# Altium project Napelem_inverter.PrjPcb (part 2 of 2)

## Sheet Connectors.SchDoc
size A4
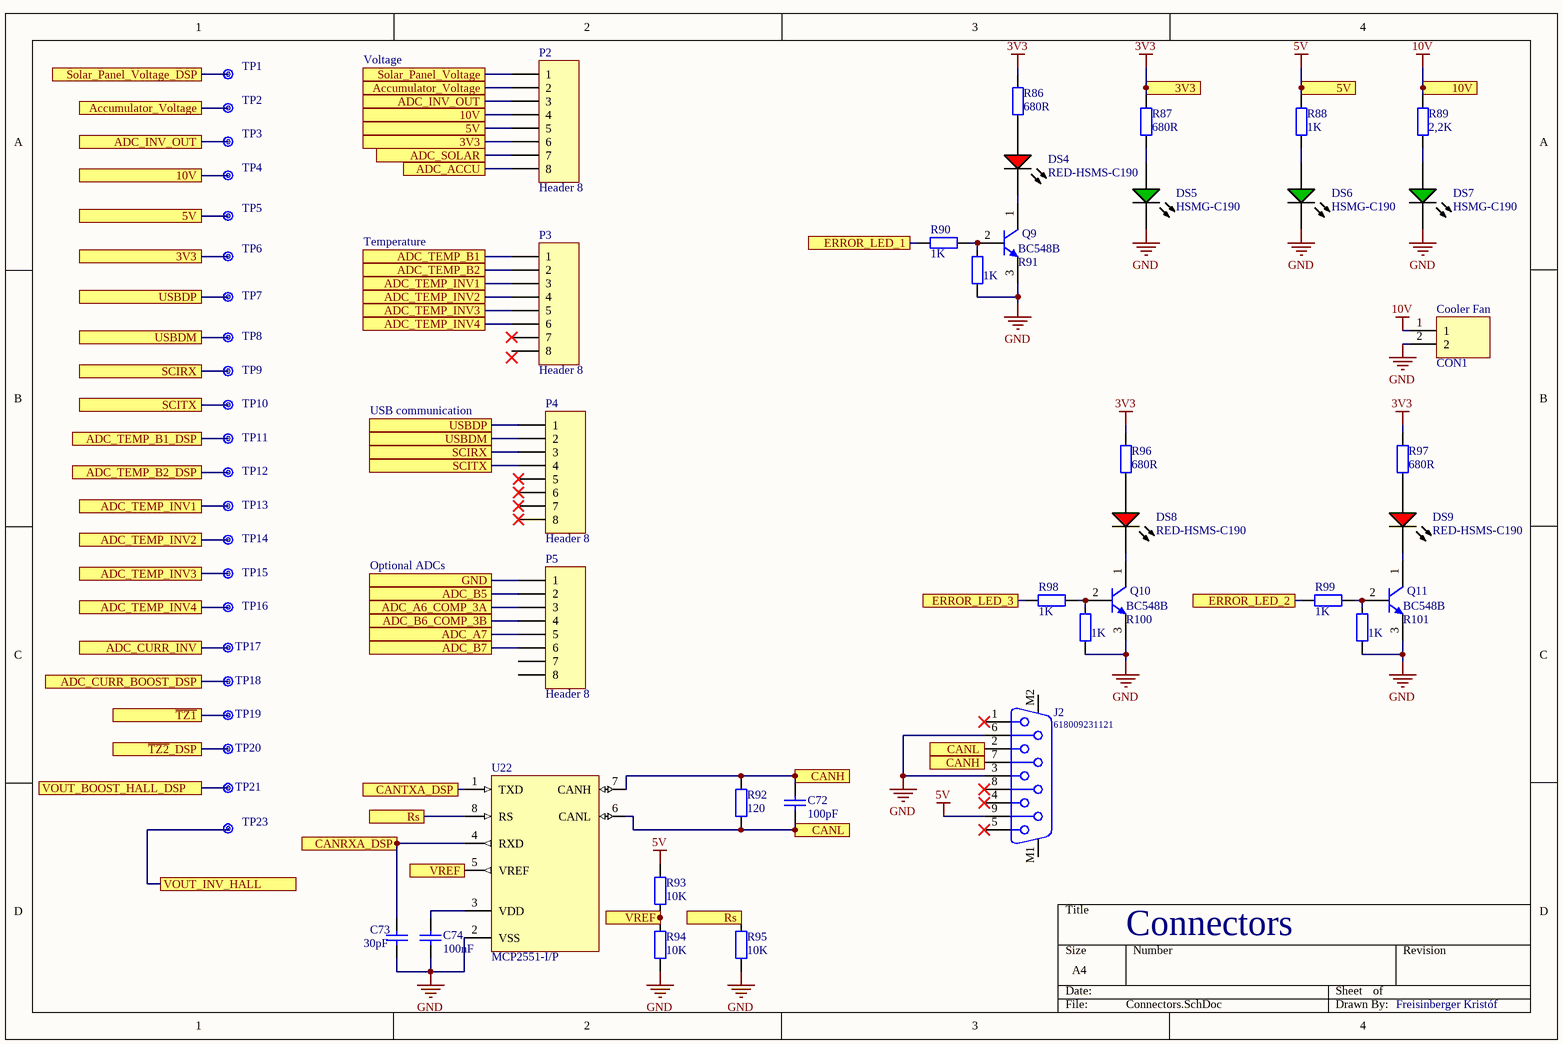
[diagram p7: Connectors.SchDoc]

### Parts
C72  100pF  [FP_0805_CAP_085]
C73  30pF  [FP_0805_CAP_085]
C74  100nF  [FP_0805_CAP_085]
CON1  Connector  [FP_CONN2_TAP_254MM_90]  (value not drawn)
DS4  RED-HSMS-C190  [AVAG-HSMX-C190_V]
DS5  HSMG-C190  [AVAG-HSMX-C190_V]
DS6  HSMG-C190  [AVAG-HSMX-C190_V]
DS7  HSMG-C190  [AVAG-HSMX-C190_V]
DS8  RED-HSMS-C190  [AVAG-HSMX-C190_V]
DS9  RED-HSMS-C190  [AVAG-HSMX-C190_V]
J2  618009231121  [618009231121]
P2  Header 8  [HDR1X8]
P3  Header 8  [HDR1X8]
P4  Header 8  [HDR1X8]
P5  Header 8  [HDR1X8]
Q9  BC548B  [ONSC-TO-92-3-29-11_AM_BL]
Q10  BC548B  [ONSC-TO-92-3-29-11_AM_BL]
Q11  BC548B  [ONSC-TO-92-3-29-11_AM_BL]
R86  680R  [FP_0805_RES]
R87  680R  [FP_0805_RES]
R88  1K  [FP_0805_RES]
R89  2,2K  [FP_0805_RES]
R90  1K  [FP_0805_RES]
R91  1K  [FP_0805_RES]
R92  120  [FP_0805_RES]
R93  10K  [FP_0805_RES]
R94  10K  [FP_0805_RES]
R95  10K  [FP_0805_RES]
R96  680R  [FP_0805_RES]
R97  680R  [FP_0805_RES]
R98  1K  [FP_0805_RES]
R99  1K  [FP_0805_RES]
R100  1K  [FP_0805_RES]
R101  1K  [FP_0805_RES]
TP1  TestPoint  [Test_Point]  (value not drawn)  (no BOM)
TP2  TestPoint  [Test_Point]  (value not drawn)  (no BOM)
TP3  TestPoint  [Test_Point]  (value not drawn)  (no BOM)
TP4  TestPoint  [Test_Point]  (value not drawn)  (no BOM)
TP5  TestPoint  [Test_Point]  (value not drawn)  (no BOM)
TP6  TestPoint  [Test_Point]  (value not drawn)  (no BOM)
TP7  TestPoint  [Test_Point]  (value not drawn)  (no BOM)
TP8  TestPoint  [Test_Point]  (value not drawn)  (no BOM)
TP9  TestPoint  [Test_Point]  (value not drawn)  (no BOM)
TP10  TestPoint  [Test_Point]  (value not drawn)  (no BOM)
TP11  TestPoint  [Test_Point]  (value not drawn)  (no BOM)
TP12  TestPoint  [Test_Point]  (value not drawn)  (no BOM)
TP13  TestPoint  [Test_Point]  (value not drawn)  (no BOM)
TP14  TestPoint  [Test_Point]  (value not drawn)  (no BOM)
TP15  TestPoint  [Test_Point]  (value not drawn)  (no BOM)
TP16  TestPoint  [Test_Point]  (value not drawn)  (no BOM)
TP17  TestPoint  [Test_Point]  (value not drawn)  (no BOM)
TP18  TestPoint  [Test_Point]  (value not drawn)  (no BOM)
TP19  TestPoint  [Test_Point]  (value not drawn)  (no BOM)
TP20  TestPoint  [Test_Point]  (value not drawn)  (no BOM)
TP21  TestPoint  [Test_Point]  (value not drawn)  (no BOM)
TP23  TestPoint  [Test_Point]  (value not drawn)  (no BOM)
U22  MCP2551-I/P  [PDIP300-P8]

### Ports
3V3, 5V, 10V, Accumulator_Voltage, ADC_A6_COMP_3A, ADC_A7, ADC_ACCU, ADC_B5, ADC_B6_COMP_3B, ADC_B7, ADC_CURR_BOOST_DSP, ADC_CURR_INV, ADC_INV_OUT, ADC_SOLAR, ADC_TEMP_B1, ADC_TEMP_B1_DSP, ADC_TEMP_B2, ADC_TEMP_B2_DSP, ADC_TEMP_INV1, ADC_TEMP_INV2, ADC_TEMP_INV3, ADC_TEMP_INV4, CANH, CANL, CANRXA_DSP, CANTXA_DSP, ERROR_LED_1, ERROR_LED_2, ERROR_LED_3, GND, Rs, SCIRX, SCITX, Solar_Panel_Voltage, Solar_Panel_Voltage_DSP, USBDM, USBDP, VOUT_BOOST_HALL_DSP, VOUT_INV_HALL, VREF, ~{TZ1}, ~{TZ2}_DSP

### Nets
3V3: P2.6 R86.2 R87.2 R96.2 R97.2 TP6.1 ; port 3V3
5V: J2.9 P2.5 R88.2 R93.2 TP5.1 ; port 5V
10V: CON1.1 P2.4 R89.2 TP4.1 ; port 10V
GND: C73.1 C74.1 CON1.2 DS5.2(K) DS6.2(K) DS7.2(K) J2.3 J2.6 Q9.3(E) Q10.3(E) Q11.3(E) R91.1 R94.1 R95.1 R100.1 R101.1 U22.2(VSS)  [project net Accumulator_GND]
Fuse_Input: P2.1 ; port Solar_Panel_Voltage
NetC11_2: P2.7 ; port ADC_SOLAR
NetC12_2: P2.8 ; port ADC_ACCU
NetC14_1: TP1.1 ; port Solar_Panel_Voltage_DSP
NetC31_2: P2.2 TP2.1 ; port Accumulator_Voltage
NetC65_1: TP17.1 ; port ADC_CURR_INV
NetC72_1: C72.1 J2.2 R92.1 U22.6(CANL) ; port CANL
NetC72_2: C72.2 J2.7 R92.2 U22.7(CANH) ; port CANH
NetC73_2: C73.2 U22.4(RXD) ; port CANRXA_DSP
NetC74_2: C74.2 U22.3(VDD)
NetDS4_1: DS4.1(A) R86.1
NetDS4_2: DS4.2(K) Q9.1(C)
NetDS5_1: DS5.1(A) R87.1
NetDS6_1: DS6.1(A) R88.1
NetDS7_1: DS7.1(A) R89.1
NetDS8_1: DS8.1(A) R96.1
NetDS8_2: DS8.2(K) Q10.1(C)
NetDS9_1: DS9.1(A) R97.1
NetDS9_2: DS9.2(K) Q11.1(C)
NetJ3_1: TP20.1 ; port ~{TZ2}_DSP
NetJ3_2: TP18.1 ; port ADC_CURR_BOOST_DSP
NetJ3_4: TP11.1 ; port ADC_TEMP_B1_DSP
NetJ3_6: TP12.1 ; port ADC_TEMP_B2_DSP
NetJ3_8: TP21.1 ; port VOUT_BOOST_HALL_DSP
NetJ4_4: P3.1 ; port ADC_TEMP_B1
NetJ4_6: P3.2 ; port ADC_TEMP_B2
NetP2_3: P2.3 TP3.1 ; port ADC_INV_OUT
NetP3_3: P3.3 TP13.1 ; port ADC_TEMP_INV1
NetP3_4: P3.4 TP14.1 ; port ADC_TEMP_INV2
NetP3_5: P3.5 TP15.1 ; port ADC_TEMP_INV3
NetP3_6: P3.6 TP16.1 ; port ADC_TEMP_INV4
NetP4_1: P4.1 TP7.1 ; port USBDP
NetP4_2: P4.2 TP8.1 ; port USBDM
NetP4_3: P4.3 TP9.1 ; port SCIRX
NetP4_4: P4.4 TP10.1 ; port SCITX
NetP5_1: P5.1 ; port GND
NetP5_2: P5.2 ; port ADC_B5
NetP5_3: P5.3 ; port ADC_A6_COMP_3A
NetP5_4: P5.4 ; port ADC_B6_COMP_3B
NetP5_5: P5.5 ; port ADC_A7
NetP5_6: P5.6 ; port ADC_B7
NetQ9_2: Q9.2(B) R90.2 R91.2
NetQ10_2: Q10.2(B) R98.2 R100.2
NetQ11_2: Q11.2(B) R99.2 R101.2
NetR72_1: TP19.1 ; port ~{TZ1}
NetR73_1: TP23.1 ; port VOUT_INV_HALL
NetR90_1: R90.1 ; port ERROR_LED_1
NetR93_1: R93.1 R94.2 U22.5(VREF) ; port VREF
NetR95_2: R95.2 U22.8(RS) ; port Rs
NetR98_1: R98.1 ; port ERROR_LED_3
NetR99_1: R99.1 ; port ERROR_LED_2
NetU1_40: U22.1(TXD) ; port CANTXA_DSP

Not connected (* = marked no-connect by the designer): J2 1* 4* 5* 8* M1 M2; P3 7* 8; P4 5* 6* 7* 8*; P5 7 8

### Notes on the sheet
- Voltage
- Temperature
- (near CON1) Cooler Fan
- USB communication
- Optional ADCs
- Connectors
- Freisinberger Kristóf

### Library data of the parts
C72-C74 = CAP: Capacitor
  C72: Value: 100pF
  C73: Value: 30pF
  C74: Value: 100nF
CON1 = Connector_2pin: 2pin connector; Reference: 100.240.80; Supplier: hestore
DS4 DS8 DS9 = RED-CMP-2000-06427-1: LED Uni-Color Red, 52 mW, 20 mA, -40 to 85 degC, 2-Pin SMD, RoHS, Tape and Reel; Manufacturer: Avago; Reverse Voltage: 5V; Viewing Angle: 170deg; High Brightness: No; Lens Type: ColorlessDiffused; DELETED: Compliant; Product Height (mm): 0.8mm; Dominant Wave Length: 626nm; Number of  Elements: 1; Chip Material: GaP; Lum Intensity: 10mcd; Product Length (mm): 1.6mm; Forward Voltage: 2.6V; Power Dissipation: 52W; Shape Type: Rectangular; Forward Current: 25mA; Peak Wavelength: 630nm; Test Current (It): 20mA; Main Category: ChipLED; Lens Dimensions: 1x0.8x0.5mm; Pin Count: 2; Package Reference: HSMX-C190; Mounting Technology: SurfaceMount; Mounting: SurfaceMount; Datasheet URL: http://docs.avagotech.com/docs/AV02-0551EN; Package Type: ChipLed; Operating Temperature Classification: Industrial; Datasheet Version: 03/2012; Operating Temp Range: -40Cto85C; Emitting Color: Red; Rad Hardened: No; Manufacturer URL: http://www.avagotech.com/; Luminous Intensity: 10mcd; Package Description: 2-Pin Surface Mount Device, Body 1.6 x 0.8 mm, Height 0.9 mm; Type: Uni-Color; Packaging: TapeandReel; Product Depth (mm): 0.8mm
DS5-DS7 = LED_G_CMP-1744-00002-1: Chip LED, Green, 2.2 V, -40 to 85 degC, 2-Pin SMD, RoHS, Tape and Reel; Frequency: 400 KHz; Max Supply Voltage: 5.5 V; Access Time: 3500 ns; Clock Frequency: 100 KHz; Case\Package: SOIC; Density: 32 kb; Nominal Supply Current: 2 mA; Interface: Serial; Min Supply Voltage: 1.7 V; Packaging: Tape and Reel; PackageReference: HSMX-C190; ComponentLink2URL: http://docs.avagotech.com/docs/AV02-0551EN; RoHSCompliant: true; Pins: 8; REACH SVHC: No SVHC; Max Operating Temperature: 85 degC; Width: 4 mm; Radiation Hardening: No; Package Quantity: 3000; ComponentLink3Description: Package Specification; ComponentLink1Description: Manufacturer URL; Min Operating Temperature: -40 degC; PackageDescription: 2-Pin Surface Mount Device, Body 1.6 x 0.8 mm, Height 0.9 mm; Max Clock Frequency: 100 KHz; Height: 1.5 mm; ComponentLink1URL: http://www.avagotech.com/; DatasheetVersion: Mar-12; ComponentLink2Description: Datasheet; Mount: Surface Mount; Length: 5 mm; ComponentLink3URL: http://www.fairchildsemi.com/dwg/MA/MA03D.pdf
J2 = CMP-1502-00200-1: Female PCB Connector with Hex Screw WR-DSUB, 8.08 mm, Angled, 9 pins; Manufacturer: Wurth Elektronik; Contact Resistance: 30mOhm; Pin Number: 9; Working Voltage: 125VAC; Rated Current: 3A; Gender: Female; Datasheet URL: https://katalog.we-online.de/em/datasheet/6180xx231121.pdf; Packaging: Tray; Package Reference: 618009231121; Operating Temperature: -40to85degC; Manufacturer URL: http://www.we-online.de; Publisher: WurthElektronik; Mounting Technology: THT; Part Number: 618009231121; Orientation: Angled
P2-P5 = Header 8: Header, 8-Pin; Reference: 100.240.95; LatestRevisionDate: 17-Jul-2002; LatestRevisionNote: Re-released for DXP Platform.; Publisher: Altium Limited; Supplier: hestore
Q9-Q11 = CMP-1048-01603-1: Amplifier Transistor, NPN Silicon, 3-Pin TO-92, Pb-Free, Tape and Reel; Manufacturer: On Semiconductor; PartNumber: BC548BRL1G; fT Min (MHz): 150; IC Continuous (A): 0.1; ComponentLink3Description: Package Specification; ComponentLink1Description: Manufacturer URL; Packing: Tape and Reel; ComponentLink1URL: http://www.onsemi.com/; PackageReference: TO-92-3-29-11_AM_BL; Polarity: NPN; ComponentLink3URL: http://www.onsemi.com/pub_link/Collateral/MAC97-D.PDF; DatasheetVersion: Rev. 7; PackageDescription: 3-Pin Transistor Outline, Body 4.825 x 3.685 mm, Pitch 1.27 mm; ComponentLink2Description: Datasheet; Mounting Technology: Through Hole; PackageVersion: Rev. AM; RoHS: TRUE; ComponentLink2URL: http://www.onsemi.com/pub_link/Collateral/BC546-D.PDF
R86-R101 = RES: Resistor
  R86 R87 R96 R97: Value: 680R
  R88 R90 R91 R98-R101: Value: 1K
  R89: Value: 2,2K
  R92: Value: 120
  R93-R95: Value: 10K
TP1-TP21 TP23 = TestPoint: Test Point
U22 = CMP-0186-00101-2: High-Speed CAN Transceiver, 8-Pin PDIP, Industrial Temperature; PackageDescription: 8-Lead Plastic Dual In-Line (P) - 300 mil Body [PDIP]; Code_JEDEC: MS-001; ComponentLink1Description: Manufacturer URL; DatasheetVersion: revF, Jul-2010; PackageReference: PDIP300-P8; ComponentLink3Description: Package Specification; ComponentLink3URL: http://www.microchip.com/stellent/groups/techpub_sg/documents/packagingspec/en012702.pdf; ComponentLink2URL: http://ww1.microchip.com/downloads/en/DeviceDoc/21667F.pdf; ComponentLink1URL: http://www.microchip.com/; RevisionNote: URLs added. DatasheetVersion updated.; PackageVersion: revBB, Aug-2009; ComponentLink2Description: Datasheet

## Sheet Hall_sensor.SchDoc
size A4
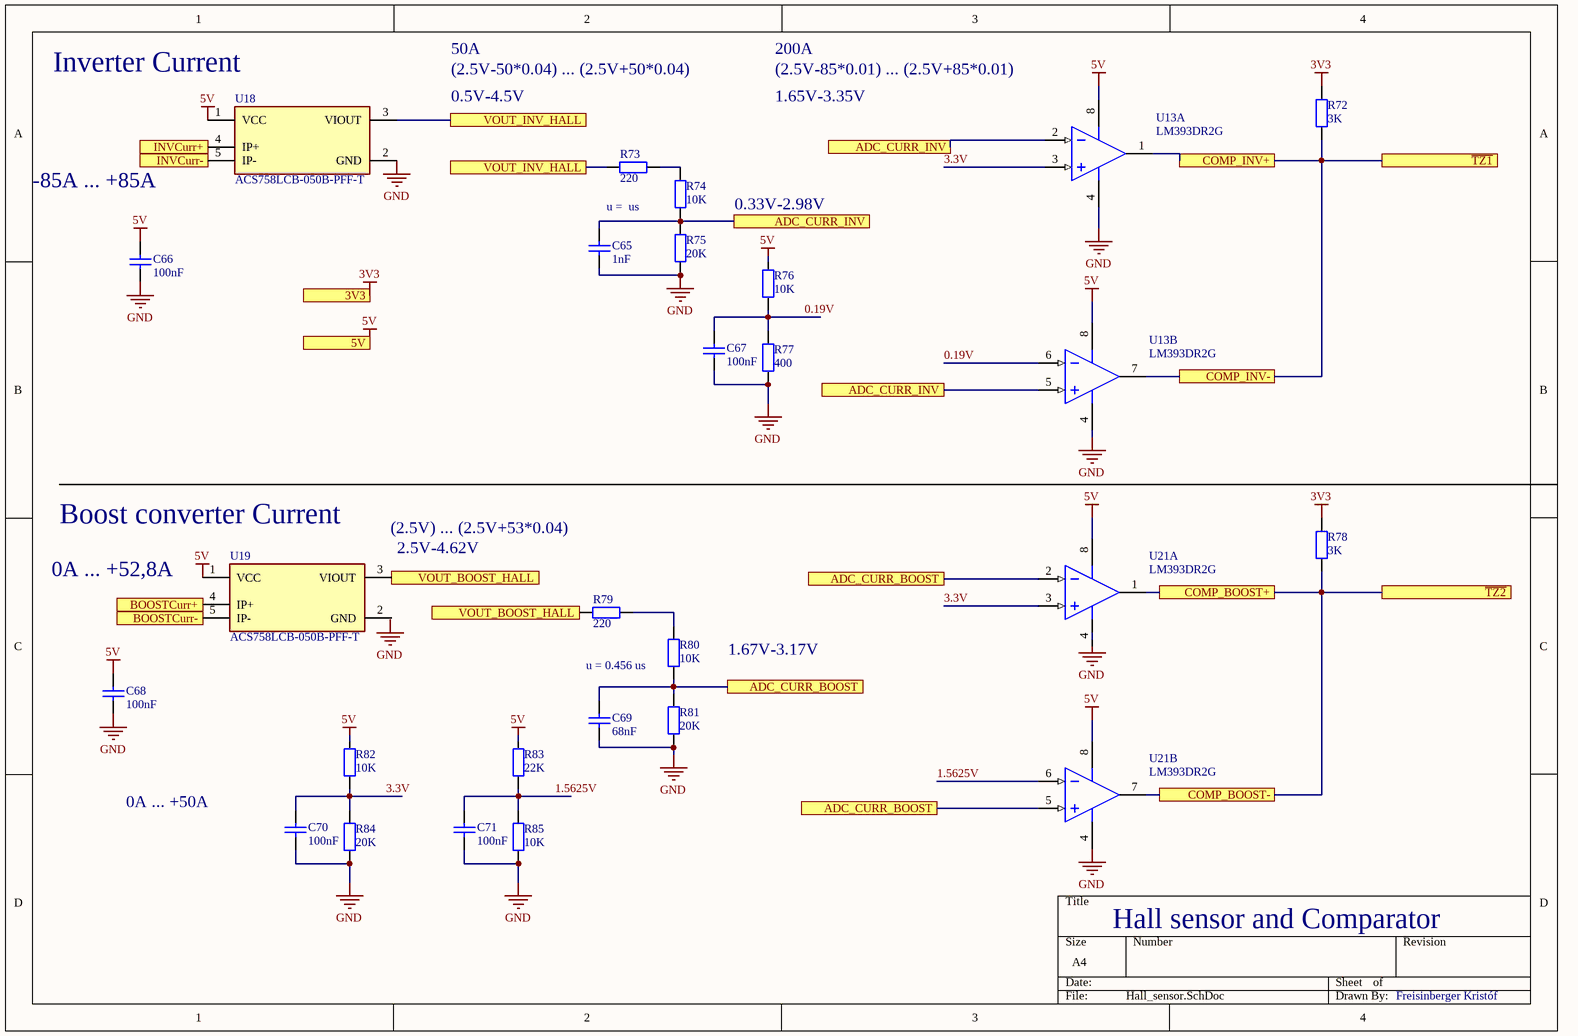
[diagram p8: Hall_sensor.SchDoc]

### Parts
C65  1nF  [FP_0805_CAP_085]
C66  100nF  [FP_0805_CAP_085]
C67  100nF  [FP_0805_CAP_085]
C68  100nF  [FP_0805_CAP_085]
C69  68nF  [FP_0805_CAP_085]
C70  100nF  [FP_0805_CAP_085]
C71  100nF  [FP_0805_CAP_085]
R72  3K  [FP_0805_RES]
R73  220  [FP_0805_RES]
R74  10K  [FP_0805_RES]
R75  20K  [FP_0805_RES]
R76  10K  [FP_0805_RES]
R77  400  [FP_0805_RES]
R78  3K  [FP_0805_RES]
R79  220  [FP_0805_RES]
R80  10K  [FP_0805_RES]
R81  20K  [FP_0805_RES]
R82  10K  [FP_0805_RES]
R83  22K  [FP_0805_RES]
R84  20K  [FP_0805_RES]
R85  10K  [FP_0805_RES]
U13  LM393DR2G  [ONSC-SOIC-8-751-07_V]  (parts A,B of 2)
U18  ACS758LCB-050B-PFF-T  [FP-CB-5-PFF-MFG]
U19  ACS758LCB-050B-PFF-T  [FP-CB-5-PFF-MFG]
U21  LM393DR2G  [ONSC-SOIC-8-751-07_V]  (parts A,B of 2)

### Ports
3V3, 5V, ADC_CURR_BOOST, ADC_CURR_INV, BOOSTCurr+, BOOSTCurr-, COMP_BOOST+, COMP_BOOST-, COMP_INV+, COMP_INV-, INVCurr+, INVCurr-, VOUT_BOOST_HALL, VOUT_INV_HALL, ~{TZ1}, ~{TZ2}

### Nets
3V3: R72.2 R78.2 ; port 3V3
5V: C66.1 C68.1 R76.1 R82.1 R83.1 U13.8(VCC) U18.1(VCC) U19.1(VCC) U21.8(VCC) ; port 5V
GND: C65.2 C66.2 C67.2 C68.2 C69.2 C70.2 C71.2 R75.1 R77.2 R81.2 R84.2 R85.2 U13.4(GND) U18.2(GND) U21.4(GND)  [project net Accumulator_GND]
0.19V: C67.1 R76.2 R77.1 U13.6(INB-)
1.5625V: C71.1 R83.2 R85.1 U21.6(INB-)
3.3V: C70.1 R82.2 R84.1 U13.3(INA+) U21.3(INA+)
NetC44_1: U18.5(IP-) ; port INVCurr-
NetC52_1: U18.4(IP+) ; port INVCurr+
NetC60_1: U19.5(IP-) ; port BOOSTCurr-
NetC65_1: C65.1 R74.2 R75.2 U13.2(INA-) U13.5(INB+) ; port ADC_CURR_INV
NetC69_1: C69.1 R80.2 R81.1 U21.2(INA-) U21.5(INB+) ; port ADC_CURR_BOOST
NetJ4_1: R78.1 U21.1(OUTA) U21.7(OUTB) ; port COMP_BOOST+, port COMP_BOOST-, port ~{TZ2}
NetJ4_8: R79.2 U19.3(VIOUT) ; port VOUT_BOOST_HALL
NetL2_2: U19.4(IP+) ; port BOOSTCurr+
NetR72_1: R72.1 U13.1(OUTA) U13.7(OUTB) ; port COMP_INV+, port COMP_INV-, port ~{TZ1}
NetR73_1: R73.1 U18.3(VIOUT) ; port VOUT_INV_HALL
NetR73_2: R73.2 R74.1
NetR79_1: R79.1 R80.1

Not connected (* = marked no-connect by the designer): U19 2(GND)

### Notes on the sheet
- (near U18) Inverter Current
- (2.5V-50*0.04) ... (2.5V+50*0.04)
- 0.5V-4.5V
- 50A
- (near U13) (2.5V-85*0.01) ... (2.5V+85*0.01)
- 1.65V-3.35V
- 200A
- -85A ... +85A
- u =  us
- 0.33V-2.98V
- (near U19) 0A ... +52,8A
- (near U19) Boost converter Current
- (2.5V) ... (2.5V+53*0.04)
- (near U19) 2.5V-4.62V
- 1.67V-3.17V
- (near R80) u = 0.456 us
- 0A ... +50A
- Hall sensor and Comparator
- Freisinberger Kristóf
- Labels drawn without touching a wire or pin: GND

### Library data of the parts
C65-C71 = CAP: Capacitor
  C65: Value: 1nF
  C66-C68 C70 C71: Value: 100nF
  C69: Value: 68nF
R72-R85 = RES: Resistor
  R72 R78: Value: 3K
  R73 R79: Value: 220
  R74 R76 R80 R82 R85: Value: 10K
  R75 R81 R84: Value: 20K
  R77: Value: 400
  R83: Value: 22K
U13 U21 = CMP-1305-00048-1: Low Offset Voltage Dual Comparators, 2 to 36 V, 0 to 70 degC, 8-Pin SOIC, Pb-Free, Tape and Reel; Manufacturer: On Semiconductor; VCC Min (V): 2; VCC Max (V): 36; ICC Typ (mA): 0.4; IO Typ (mA): 16; ComponentLink1Description: Manufacturer URL; ComponentLink2Description: Datasheet; Packing: Tape and Reel; PackageVersion: Rev. AK, 02/2011; RoHS: TRUE; Mounting Technology: Surface Mount; ComponentLink3URL: http://www.onsemi.com/pub_link/Collateral/751-07.PDF; PackageReference: SOIC-8-751-07; PackageDescription: 8-Pin Small Outline Integrated Circuit, Body 4.9 x 3.9 mm, Pitch 1.27 mm; ComponentLink3Description: Package Specification; ComponentLink1URL: http://www.onsemi.com/; PartNumber: LM393DR2G; DatasheetVersion: Rev. 25; ComponentLink2URL: http://www.onsemi.com/pub_link/Collateral/LM393-D.PDF
U18 U19 = ACS758LCB-CMP-82923-000254-1: SENSOR CURRENT HALL 50A AC/DC; Operating Supply Voltage: 5V; Max Supply Current: 13.5mA; Frequency: 120kHz; Quiescent Current: 10mA; Response Time: 4us; Sensitivity: 40mV/A; Output Current: 1mA; Linearity: 1%; Polarity: Bidirectional; Accuracy: 2%; Number of Channels: 1; Max Supply Voltage: 5.5V; Min Supply Voltage: 3V; Radiation Hardening: No; Packaging: Rail/Tube; Length: 10mm; Height: 7mm; Lead Free: Lead Free; Current Sensing: 50A; Number of Pins: 5; Min Operating Temperature: -40°C; RoHS Compliant: Yes; REACH SVHC: No SVHC; Max Operating Temperature: 150°C; Package Quantity: 34; Bandwidth: 120kHz; Mount: Through Hole; Width: 13mm; Series: -

## Sheet USB_and_FTDI.SchDoc
size A4
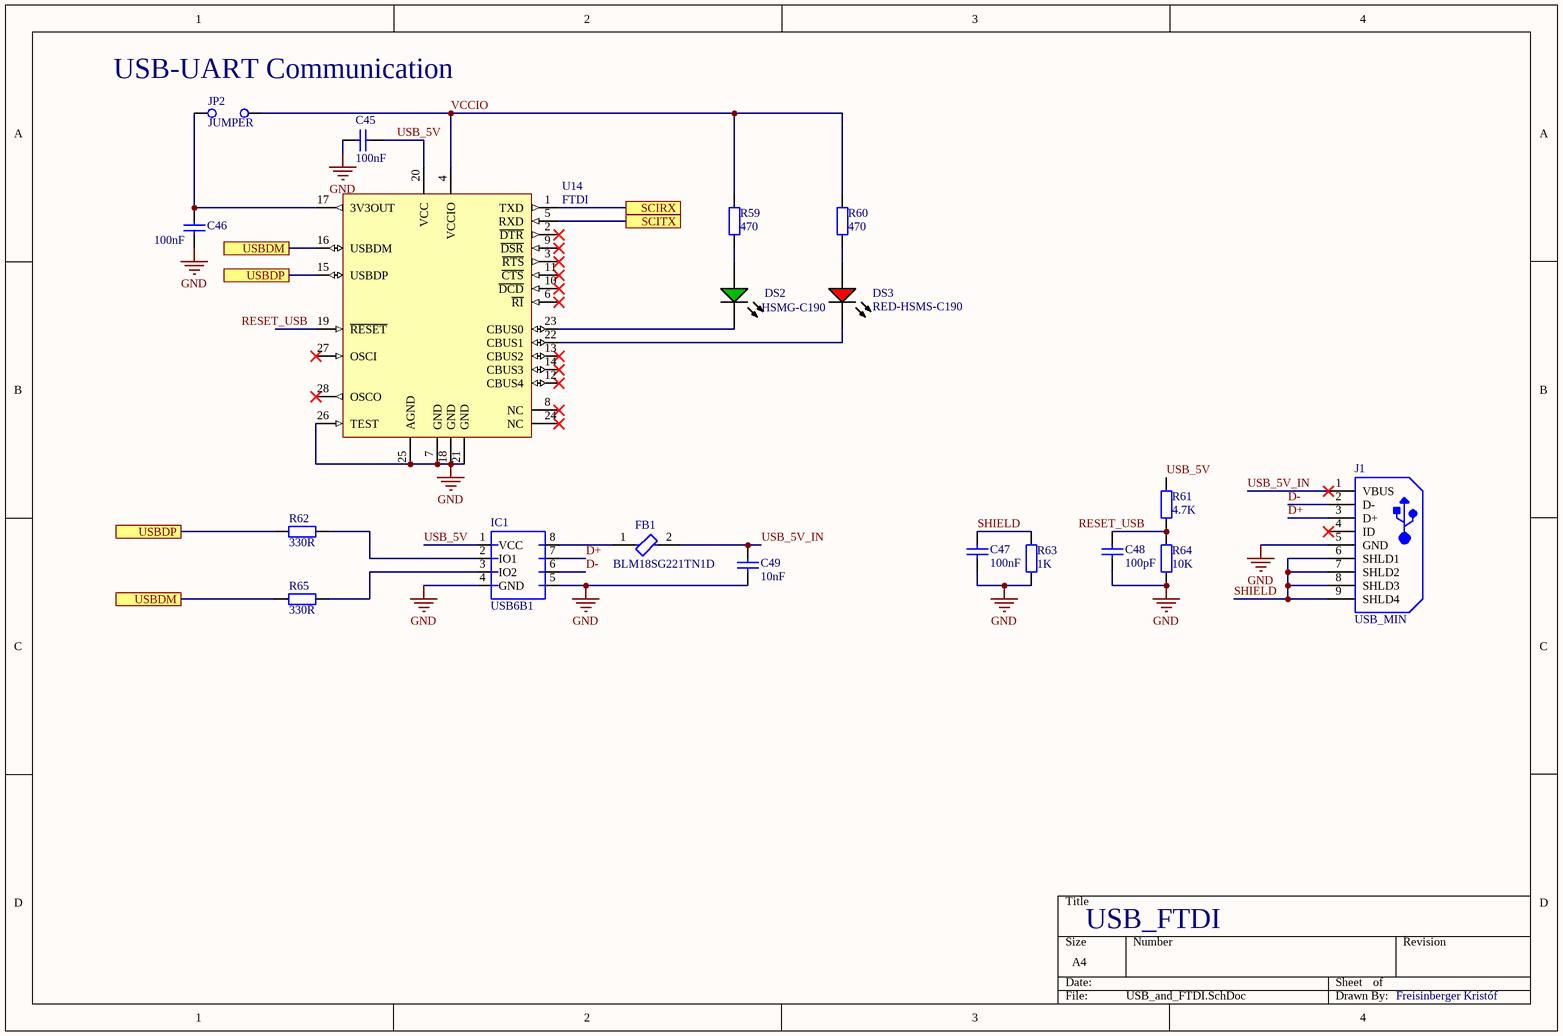
[diagram p9: USB_and_FTDI.SchDoc]

### Parts
C45  100nF  [FP_0805_CAP_085]
C46  100nF  [FP_0805_CAP_085]
C47  100nF  [FP_0805_CAP_085]
C48  100pF  [FP_0805_CAP_085]
C49  10nF  [FP_0805_CAP_085]
DS2  HSMG-C190  [AVAG-HSMX-C190_V]
DS3  RED-HSMS-C190  [AVAG-HSMX-C190_V]
FB1  BLM18SG221TN1D  [FP-BLM18-0_15-t0_5-IPC_A]
IC1  USB6B1  [INF-P-DSO-8-3_M - duplicate1]
J1  USB_MIN  [FCI-10033526-N3212LF_V]
JP2  JUMPER  [FP_CONN2_TUSKE_254MM]
R59  470  [FP_0805_RES]
R60  470  [FP_0805_RES]
R61  4.7K  [FP_0805_RES]
R62  330R  [FP_0805_RES]
R63  1K  [FP_0805_RES]
R64  10K  [FP_0805_RES]
R65  330R  [FP_0805_RES]
U14  FTDI  [SSOP-28_N]

### Ports
SCIRX, SCITX, USBDM, USBDP

### Nets
GND: C45.1 C46.1 C47.1 C48.1 C49.1 IC1.4(GND) IC1.5(GND@2) J1.5(GND) R63.1 R64.1 U14.7(GND) U14.18(GND) U14.21(GND) U14.25(AGND) U14.26(TEST)  [project net Accumulator_GND]
D+: IC1.7(IO1@2) J1.3(D+)
D-: IC1.6(IO2@2) J1.2(D-)
RESET_USB: C48.2 R61.1 R64.2 U14.19(~{RESET})
SHIELD: C47.2 J1.6(SHLD1) J1.7(SHLD2) J1.8(SHLD3) J1.9(SHLD4) R63.2
USB_5V: C45.2 IC1.1(VCC) R61.2 U14.20(VCC)
USB_5V_IN: C49.2 FB1.2 J1.1(VBUS)
VCCIO: JP2.2(C2) R59.2 R60.2 U14.4(VCCIO)
NetC46_2: C46.2 JP2.1(C1) U14.17(3V3OUT)
NetDS2_1: DS2.1(A) R59.1
NetDS2_2: DS2.2(K) U14.23(CBUS0)
NetDS3_1: DS3.1(A) R60.1
NetDS3_2: DS3.2(K) U14.22(CBUS1)
NetFB1_1: FB1.1 IC1.8(VCC@2)
NetIC1_2: IC1.2(IO1) R62.2
NetIC1_3: IC1.3(IO2) R65.2
NetP4_1: R62.1 U14.15(USBDP) ; port USBDP
NetP4_2: R65.1 U14.16(USBDM) ; port USBDM
NetP4_3: U14.1(TXD) ; port SCIRX
NetP4_4: U14.5(RXD) ; port SCITX

Not connected (* = marked no-connect by the designer): J1 4(ID)*; U14 2(~{DTR})* 3(~{RTS})* 6(~{RI})* 8(NC)* 9(~{DSR})* 10(~{DCD})* 11(~{CTS})* 12(CBUS4)* 13(CBUS2)* 14(CBUS3)* 24(NC)* 27(OSCI)* 28(OSCO)*

### Notes on the sheet
- (near JP2) USB-UART Communication
- USB_FTDI
- Freisinberger Kristóf

### Library data of the parts
C45-C49 = CAP: Capacitor
  C45-C47: Value: 100nF
  C48: Value: 100pF
  C49: Value: 10nF
DS2 = LED_G_CMP-1744-00002-1: as DS5 on sheet Connectors; Packaging: Tape and Reel; PackageReference: HSMX-C190; ComponentLink2URL: http://docs.avagotech.com/docs/AV02-0551EN; RoHSCompliant: true; Pins: 8; REACH SVHC: No SVHC; Max Operating Temperature: 85 degC; Width: 4 mm; Radiation Hardening: No; Package Quantity: 3000; ComponentLink3Description: Package Specification; ComponentLink1Description: Manufacturer URL; Min Operating Temperature: -40 degC; PackageDescription: 2-Pin Surface Mount Device, Body 1.6 x 0.8 mm, Height 0.9 mm; Max Clock Frequency: 100 KHz; Height: 1.5 mm; ComponentLink1URL: http://www.avagotech.com/; DatasheetVersion: Mar-12; ComponentLink2Description: Datasheet; Mount: Surface Mount; Length: 5 mm; ComponentLink3URL: http://www.fairchildsemi.com/dwg/MA/MA03D.pdf
DS3 = RED-CMP-2000-06427-1: as DS4 on sheet Connectors; Lens Dimensions: 1x0.8x0.5mm; Pin Count: 2; Package Reference: HSMX-C190; Mounting Technology: SurfaceMount; Mounting: SurfaceMount; Datasheet URL: http://docs.avagotech.com/docs/AV02-0551EN; Package Type: ChipLed; Operating Temperature Classification: Industrial; Datasheet Version: 03/2012; Operating Temp Range: -40Cto85C; Emitting Color: Red; Rad Hardened: No; Manufacturer URL: http://www.avagotech.com/; Luminous Intensity: 10mcd; Package Description: 2-Pin Surface Mount Device, Body 1.6 x 0.8 mm, Height 0.9 mm; Type: Uni-Color; Packaging: TapeandReel; Product Depth (mm): 0.8mm
FB1 = CMP-0686-00596-3: Chip Ferrite Bead, 0603, 220Ω @ 100MHz, 25%, 0.04Ω, 2.5A; Impedance: 220R; DC Resistance-Max: 40mR; Number of Circuits: 1; Test Frequency: 100MHz; Material: Ferrite; Lead Free: Lead Free; Width: 0.8mm; Max Current Rating: 2.5A; Termination: SMD/SMT; Depth: 0.95mm; Packaging: Tape and Reel; Case Code (Metric): 1608; DC Current: 2.5A; Weight: 7.1E-05oz; Min Operating Temperature: -55°C; DC Resistance (DCR): 40mR; Max Operating Temperature: 125°C; Core Material: Ferrite; Max DC Current: 2.5A; Case/Package: 0603; REACH SVHC: No SVHC; Height: 0.8mm; Number of Pins: 2; Tolerance: 25%; RoHS Compliant: Yes; Radiation Hardening: No; Current Rating: 2.5A; Number of Lines: 1; Series: BLM18S; Case Code (Imperial): 0603; Length: 1.6mm; Package Quantity: 1
IC1 = USB6B1: Clamp Ipp Tvs Diode Surface Mount 8-SO; MF: STMicroelectronics; Package: SOIC-8 STMicroelectronics; Value: *; Availability: Unavailable; SnapEDA_Link: https://www.snapeda.com/parts/USB6B1/STMicroelectronics/view-part/51146/?ref=snap; Price: None; MP: USB6B1
J1 = USB_MIN_CMP-1698-00001-3: Mini USB B-Type, 5-Pin SMD, RoHS, Tape and Reel / 10033526-N3212LF; Height: 4 mm; PackageDescription: 5-Pin Surface Mount Device, Body 9.2 x 7.7 mm, Pitch 0.8 mm; ComponentLink2Description: Datasheet; Pins: 5; RoHSCompliant: True; DatasheetVersion: Rev. N; ComponentLink1Description: Manufacturer URL; Length: 9.9 mm; PartNumber: 10033526-N3212LF; Package Quantity: 1; Packaging: Tape and Reel; Mount: Surface Mount; Mounting Technology: Surface Mount; ComponentLink1URL: http://portal.fciconnect.com/; ComponentLink2URL: http://portal.fciconnect.com/Comergent//fci/drawing/10033526.pdf
JP2 = JUMPER: Jumper Wire
R59-R65 = RES: Resistor
  R59 R60: Value: 470
  R61: Value: 4.7K
  R62 R65: Value: 330R
  R63: Value: 1K
  R64: Value: 10K
U14 = FTDI-CMP28-0078-00029-3: USB UART Asynchronous Serial Data Transfer Chip, 28-pin SSOP, Tape and Reel; PartNumber: FT232RL-Reel; PackageVersion: Mar-12; PackageReference: SSOP-28; ComponentLink2Description: Datasheet; DatasheetVersion: ver 2.10, Mar-2012; PackageDescription: 28-Pin Small Outline Package 0.65 mm Pitch; ComponentLink1Description: Manufacturer URL; RevisionNote: DatasheetVersion updated to 2.10 Mar-2012; ComponentLink1URL: http://www.ftdichip.com/; Manufacturer: FTDI; ComponentLink2URL: http://www.ftdichip.com/Support/Documents/DataSheets/ICs/DS_FT232R.pdf

## Sheet Display.SchDoc
size A4
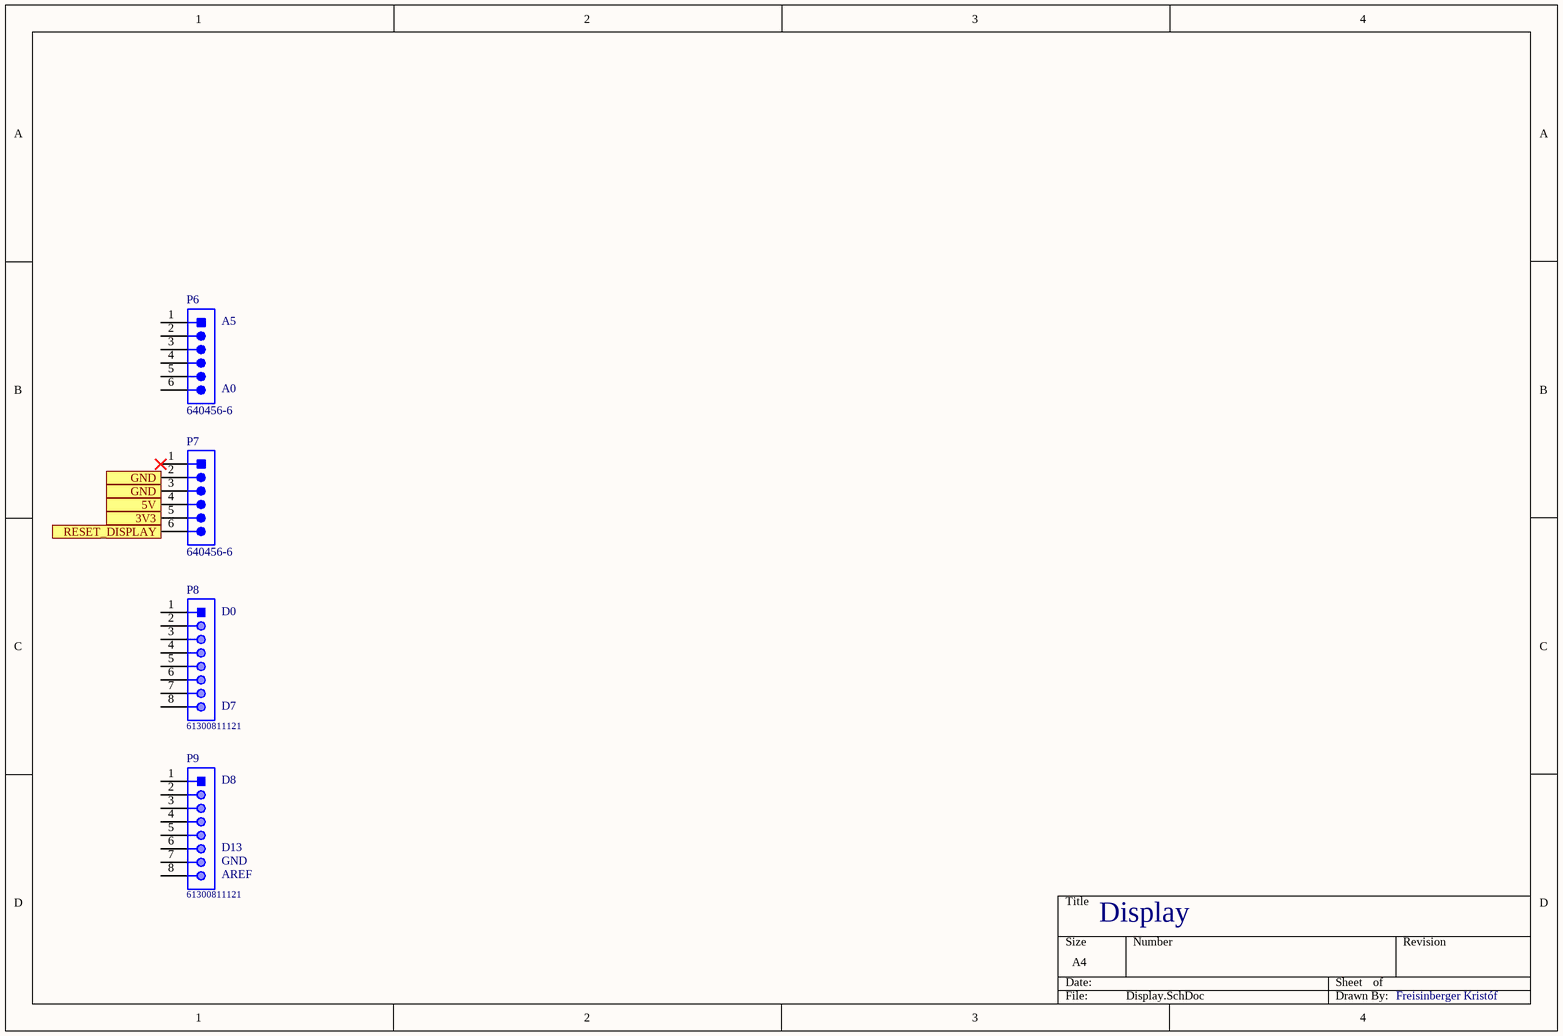
[diagram p10: Display.SchDoc]

### Parts
P6  640456-6  [TECO-640456-6_V]
P7  640456-6  [TECO-640456-6_V]
P8  61300811121  [61300811121]
P9  61300811121  [61300811121]

### Ports
3V3, 5V, GND, RESET_DISPLAY

### Nets
3V3: P7.5 ; port 3V3
5V: P7.4 ; port 5V
NetB2_3: P7.6 ; port RESET_DISPLAY
NetP5_1: P7.2 P7.3 ; port GND

Not connected (* = marked no-connect by the designer): P6 1 2 3 4 5 6; P7 1*; P8 1 2 3 4 5 6 7 8; P9 1 2 3 4 5 6 7 8

### Notes on the sheet
- (near P6) A5
- (near P6) A0
- (near P8) D0
- (near P8) D7
- (near P9) D8
- (near P9) D13
- (near P9) AREF
- (near P9) GND
- Display
- Freisinberger Kristóf

### Library data of the parts
P6 P7 = CMP-2000-05661-1: Male Header, Pitch 2.54 mm, 1 x 6 Position, Height 10.03 mm, Tail Length 3.56 mm, -55 to 105 degC, Bulk; Manufacturer: TE Connectivity; Contact Centerline Spacing: 0.100 / in.; Number of Contacts: 6; Current, Rating: 5 / A; Agency Approvals: CSA,UL; Material, Contact: CopperAlloy; Mounting Hole Size: 0.04 / "; Brand/Series: MTA-100Series; Pin Spacing: 0.1 / "; Mount Angle: Vertical; Contact Termination Area Plating: Tin; Angle: Straight; Primary Type: InterconnectSystem; Standards: RoHSCompliant,ELVCompliant,UL94V-0; Temperature, Operating: -55to+105 / °C; Material, Housing: Polyester; Special Features: Pinstrip; Color, Housing: White; Connector Type: MTA-100; Voltage, Rating: 250 / V; Termination: Solder; Package Reference: 640456-6; Size, Post: 0.025 / in.; Color: White; Datasheet URL: https://datasheet.ciiva.com/25618/0900766b80eb7fdd-25618163.pdf; Manufacturer URL: http://www.te.com/; Mounting Type: PCMount; Length, Pin: 0.14 / "; Type: PCBPlug; Length, Overall: 0.6 / "; Mounting Technology: ThroughHole; Number of Rows: 1; Contact Shape: Square; Contact Mating Area Plating: Tin; Datasheet Version: Rev. W, 05/2005; Number of Positions: 6; Package Description: Male Header, Pitch 2.54 mm, 1 x 6 Position, Height 10.03 mm, Tail Length 3.56 mm; Contact Plating: Tin; Length, Terminal Post: 0.14 / in.; Flammability Rating: UL94V-0
P8 P9 = CMP-1502-01076-1: THT Vertical Pin Header WR-PHD, Pitch 2.54 mm, Single Row, 8 pins; Manufacturer: Wurth Elektronik; Rated Current: 3A; Pin Number: 8; Working Voltage: 250VAC; Gender: Male; Contact Resistance: 20mOhm; Pitch: 2.54mm; Withstanding Voltage: 500VAC; Publisher: WurthElektronik; Operating Temperature: -40to105degC; Orientation: Vertical; Row Number: Single; Part Number: 61300811121; Package Reference: 61300811121; Mounting Technology: THT; Packaging: Bag; Manufacturer URL: http://www.we-online.de; Datasheet URL: https://katalog.we-online.de/em/datasheet/6130xx11121.pdf

## Sheet DSP_Supply.SchDoc
size A4
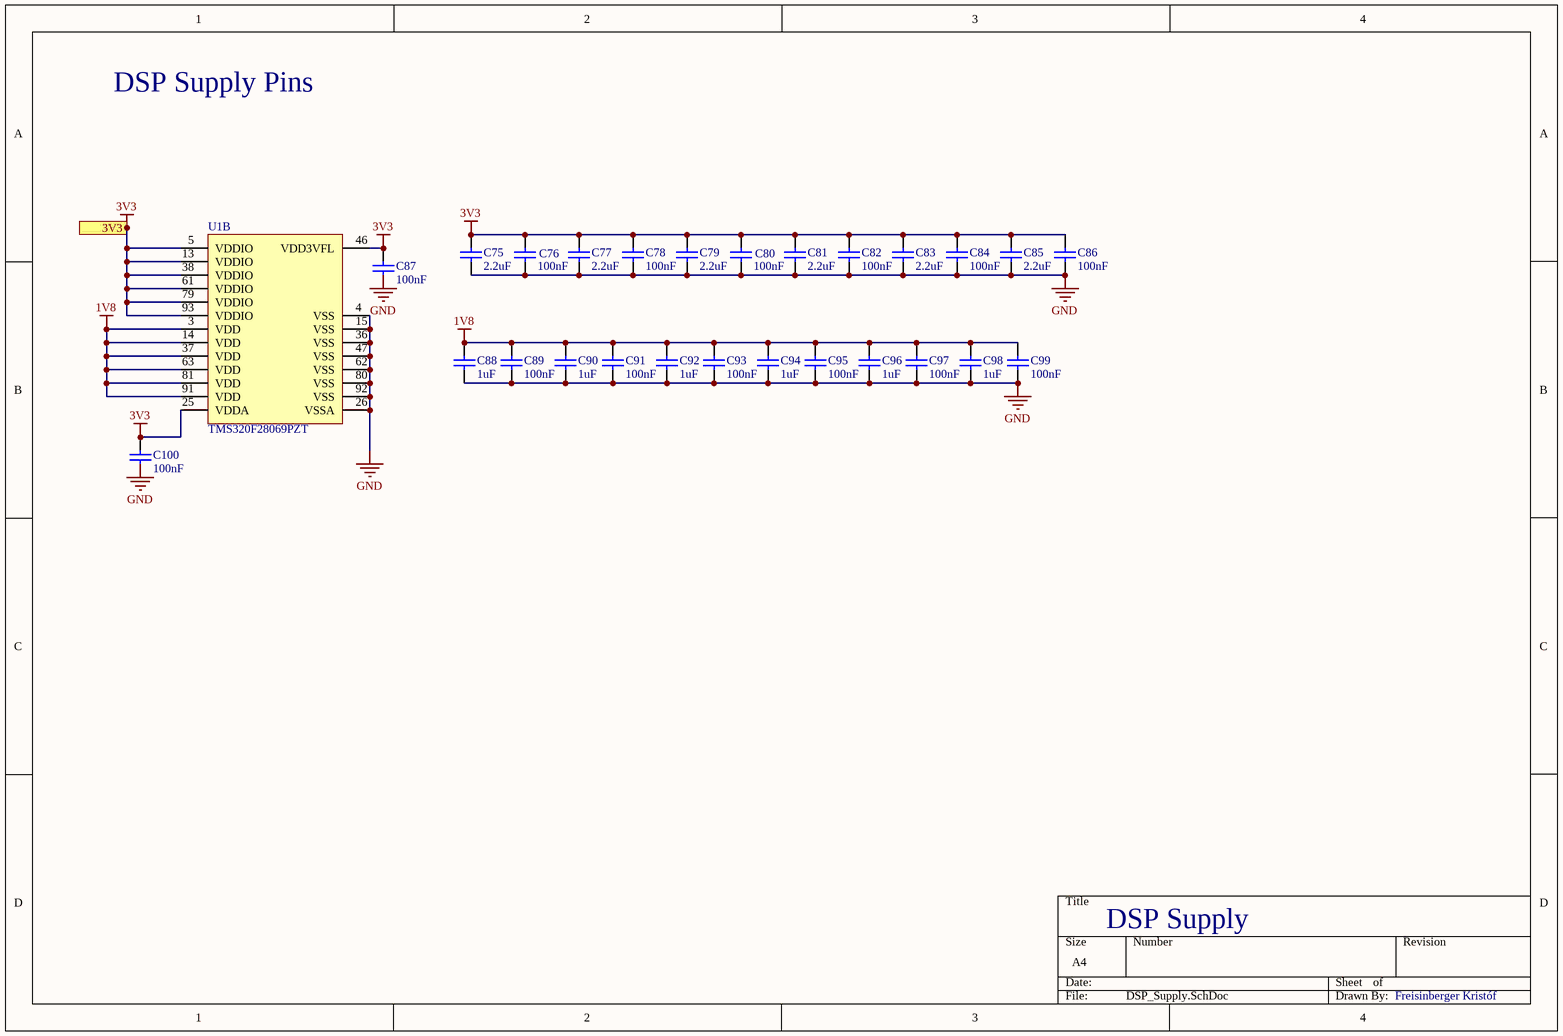
[diagram p11: DSP_Supply.SchDoc]

### Parts
C75  2.2uF  [FP_0805_CAP_085]
C76  100nF  [FP_0805_CAP_085]
C77  2.2uF  [FP_0805_CAP_085]
C78  100nF  [FP_0805_CAP_085]
C79  2.2uF  [FP_0805_CAP_085]
C80  100nF  [FP_0805_CAP_085]
C81  2.2uF  [FP_0805_CAP_085]
C82  100nF  [FP_0805_CAP_085]
C83  2.2uF  [FP_0805_CAP_085]
C84  100nF  [FP_0805_CAP_085]
C85  2.2uF  [FP_0805_CAP_085]
C86  100nF  [FP_0805_CAP_085]
C87  100nF  [FP_0805_CAP_085]
C88  1uF  [FP_0805_CAP_085]
C89  100nF  [FP_0805_CAP_085]
C90  1uF  [FP_0805_CAP_085]
C91  100nF  [FP_0805_CAP_085]
C92  1uF  [FP_0805_CAP_085]
C93  100nF  [FP_0805_CAP_085]
C94  1uF  [FP_0805_CAP_085]
C95  100nF  [FP_0805_CAP_085]
C96  1uF  [FP_0805_CAP_085]
C97  100nF  [FP_0805_CAP_085]
C98  1uF  [FP_0805_CAP_085]
C99  100nF  [FP_0805_CAP_085]
C100  100nF  [FP_0805_CAP_085]
U1  TMS320F28069PZT  [PZ0100A_N]  (part B of 2)

### Ports
3V3

### Nets
1V8: C88.2 C89.2 C90.2 C91.2 C92.2 C93.2 C94.2 C95.2 C96.2 C97.2 C98.2 C99.2 U1.3(VDD) U1.14(VDD) U1.37(VDD) U1.63(VDD) U1.81(VDD) U1.91(VDD)
3V3: C75.2 C76.2 C77.2 C78.2 C79.2 C80.2 C81.2 C82.2 C83.2 C84.2 C85.2 C86.2 C87.2 C100.2 U1.5(VDDIO) U1.13(VDDIO) U1.25(VDDA) U1.38(VDDIO) U1.46(VDD3VFL) U1.61(VDDIO) U1.79(VDDIO) U1.93(VDDIO) ; port 3V3
GND: C75.1 C76.1 C77.1 C78.1 C79.1 C80.1 C81.1 C82.1 C83.1 C84.1 C85.1 C86.1 C88.1 C89.1 C90.1 C91.1 C92.1 C93.1 C94.1 C95.1 C96.1 C97.1 C98.1 C99.1 U1.4(VSS) U1.15(VSS) U1.26(VSSA) U1.36(VSS) U1.47(VSS) U1.62(VSS) U1.80(VSS) U1.92(VSS)  [project net Accumulator_GND]

Not connected (* = marked no-connect by the designer): C87 1; C100 1

### Notes on the sheet
- DSP Supply Pins
- DSP Supply
- Freisinberger Kristóf
- Labels drawn without touching a wire or pin: GND

### Library data of the parts
C75-C100 = CAP: Capacitor
  C75 C77 C79 C81 C83 C85: Value: 2.2uF
  C76 C78 C80 C82 C84 C86 C87 C89 C91 C93 C95 C97 C99 C100: Value: 100nF
  C88 C90 C92 C94 C96 C98: Value: 1uF
U1 = DSP_100_CMP-0546-00052-3: Piccolo Microcontroller, High-Efficiency 32-Bit CPU, 100 KB, 90 MHz, FPU, VCU, 19 Ch PWM, 54 GPIO, 3.3 V, -40 to 105 degC, 100-Pin LQFP (PZ), Green (RoHS & no Sb/Br); Manufacturer: Texas Instruments; CAP/QEP: 7/2; Peak MMACS: 90; IO Supply (V): 3.3; 12-bit A/D (#Channels): 16; PWM (Ch): 19; CLA: 1; Timers: 3 32-Bit GP 1 WD; VCU: Yes; RAM (KB): 100; CPU: C28x; GPIO: 54; USB: 0; PackageVersion: 4040149/B; Operating Temperature Range (degC): -40 to 105; Mounting Technology: Surface Mount; ComponentLink2URL: http://www.ti.com/lit/ds/symlink/tms320f28069.pdf; DatasheetVersion: SPRS698D; PartNumber: TMS320F28069PZT; FPU: Yes; Frequency (MHz): 90; ComponentLink3Description: Package Specification; ComponentLink3URL: http://www.ti.com/lit/ds/symlink/tms320f28066.pdf; PackageDescription: 100-Pin Plastic Quad Flat Package, Body 14 x 14 mm, Pitch 0.5 mm; PackageReference: PZ0100A; ComponentLink1URL: http://www.ti.com/; ComponentLink2Description: Datasheet; ComponentLink1Description: Manufacturer URL; Eco Plan: Green (RoHS & no Sb/Br)

## Nets that join several sheets
3V3: PowerSupply (CONV1.1 CONV2.1 CONV2.4), Gate-Driver (5 pins), DSP (7 pins), Connectors (6 pins), Hall_sensor (R72.2 R78.2), Display (P7.5), DSP_Supply (22 pins)
5V: Measurements (7 pins), PowerSupply (CONV1.4 R47.2 R48.2), Inverter (D2.4 P13.1 R56.2), DSP (J3.10), Connectors (5 pins), Hall_sensor (9 pins), Display (P7.4)
10V: PowerSupply (5 pins), Gate-Driver (8 pins), DSP (J3.13), Connectors (CON1.1 P2.4 R89.2 TP4.1)
Accumulator_GND: Measurements (30 pins), PowerSupply (9 pins), BoostConverter (22 pins), Inverter (20 pins), Gate-Driver (12 pins), DSP (21 pins), Connectors (17 pins), Hall_sensor (15 pins), USB_and_FTDI (15 pins), DSP_Supply (32 pins)
Fuse_Input: BoostConverter (6 pins), Connectors (P2.1)
NetB2_3: DSP (5 pins), Display (P7.6)
NetC11_2: Measurements (C11.2 R38.1 R41.2), DSP (U1.23), Connectors (P2.7)
NetC12_2: Measurements (C12.2 R39.1 R42.2), DSP (U1.22), Connectors (P2.8)
NetC14_1: Measurements (R38.2), PowerSupply (6 pins), DSP (J3.14 J3.16), Connectors (TP1.1)
NetC31_2: Measurements (R39.2), Inverter (17 pins), Connectors (P2.2 TP2.1)
NetC44_1: Measurements (R20.1), Inverter (C44.1 J8.1 J8.2), Hall_sensor (U18.5)
NetC44_2: Measurements (R18.1), Inverter (C44.2 J7.1 J7.2 L3.2)
NetC52_1: Inverter (Q4.3 Q6.2 R52.1), Gate-Driver (C52.1 C53.1 U15.14), Hall_sensor (U18.4)
NetC56_1: Inverter (L3.1 Q5.3 Q7.2 R53.1), Gate-Driver (C56.1 C57.1 U16.14)
NetC58_2: BoostConverter (J4.9), Gate-Driver (C58.2 D5.1 D5.3 U17.11)
NetC60_1: BoostConverter (Q2.3 Q3.2 R50.1), Gate-Driver (C60.1 C61.1 U17.14), Hall_sensor (U19.5)
NetC65_1: DSP (U1.21), Connectors (TP17.1), Hall_sensor (5 pins)
NetC69_1: BoostConverter (J4.2), Hall_sensor (5 pins)
NetC73_2: DSP (U1.41), Connectors (C73.2 U22.4)
NetC102_2: BoostConverter (J4.13), Gate-Driver (C102.2 C103.2 C104.2 U17.3)
NetJ3_1: DSP (J3.1 U1.48), Connectors (TP20.1)
NetJ3_2: DSP (J3.2 U1.20), Connectors (TP18.1)
NetJ3_4: DSP (J3.4 U1.32), Connectors (TP11.1)
NetJ3_6: DSP (J3.6 U1.33), Connectors (TP12.1)
NetJ3_8: DSP (J3.8), Connectors (TP21.1)
NetJ4_1: BoostConverter (J4.1), Hall_sensor (R78.1 U21.1 U21.7)
NetJ4_3: BoostConverter (J4.3), Gate-Driver (U17.1)
NetJ4_4: Measurements (R30.1 U10.1), BoostConverter (J4.4), Connectors (P3.1)
NetJ4_5: BoostConverter (J4.5), Gate-Driver (U17.2)
NetJ4_6: Measurements (R31.1 U10.7), BoostConverter (J4.6), Connectors (P3.2)
NetJ4_8: BoostConverter (J4.8), Hall_sensor (R79.2 U19.3)
NetJ4_10: Measurements (U2.1 U3.1 U10.8), BoostConverter (J4.10)
NetL2_2: BoostConverter (L2.2), Hall_sensor (U19.4)
NetP2_3: Measurements (R25.2), DSP (U1.19), Connectors (P2.3 TP3.1)
NetP3_3: Measurements (R26.1 U9.1), DSP (U1.28), Connectors (P3.3 TP13.1)
NetP3_4: Measurements (R27.1 U9.7), DSP (U1.29), Connectors (P3.4 TP14.1)
NetP3_5: Measurements (R28.1 U9.8), DSP (U1.30), Connectors (P3.5 TP15.1)
NetP3_6: Measurements (R29.1 U9.14), DSP (U1.31), Connectors (P3.6 TP16.1)
NetP4_1: Connectors (P4.1 TP7.1), USB_and_FTDI (R62.1 U14.15)
NetP4_2: Connectors (P4.2 TP8.1), USB_and_FTDI (R65.1 U14.16)
NetP4_3: DSP (U1.50), Connectors (P4.3 TP9.1), USB_and_FTDI (U14.1)
NetP4_4: DSP (U1.43), Connectors (P4.4 TP10.1), USB_and_FTDI (U14.5)
NetP5_1: Connectors (P5.1), Display (P7.2 P7.3)
NetP5_2: DSP (U1.18), Connectors (P5.2)
NetP5_3: DSP (U1.17), Connectors (P5.3)
NetP5_4: DSP (U1.34), Connectors (P5.4)
NetP5_5: DSP (U1.16), Connectors (P5.5)
NetP5_6: DSP (U1.35), Connectors (P5.6)
NetQ2_1: BoostConverter (Q2.1 R50.2), Gate-Driver (R70.2)
NetQ3_1: BoostConverter (Q3.1 R51.1), Gate-Driver (R71.2)
NetQ4_1: Inverter (Q4.1 R52.2), Gate-Driver (R66.2)
NetQ5_1: Inverter (Q5.1 R53.2), Gate-Driver (R67.2)
NetQ6_1: Inverter (Q6.1 R54.2), Gate-Driver (R68.2)
NetQ7_1: Inverter (Q7.1 R55.2), Gate-Driver (R69.2)
NetR3_2: Gate-Driver (U15.1), DSP (R3.2 U1.84)
NetR4_2: Gate-Driver (U16.1), DSP (R4.2 U1.9)
NetR5_2: Gate-Driver (U16.2), DSP (R5.2 U1.10)
NetR6_2: Gate-Driver (U15.2), DSP (R6.2 U1.83)
NetR57_1: Inverter (R57.1), DSP (U1.66)
NetR72_1: DSP (U1.42), Connectors (TP19.1), Hall_sensor (R72.1 U13.1 U13.7)
NetR73_1: Connectors (TP23.1), Hall_sensor (R73.1 U18.3)
NetR90_1: DSP (U1.69), Connectors (R90.1)
NetR98_1: DSP (U1.85), Connectors (R98.1)
NetR99_1: DSP (U1.75), Connectors (R99.1)
NetU1_40: DSP (U1.40), Connectors (U22.1)